# EAGLE design cndy-001 (EAGLE 9.6.2)
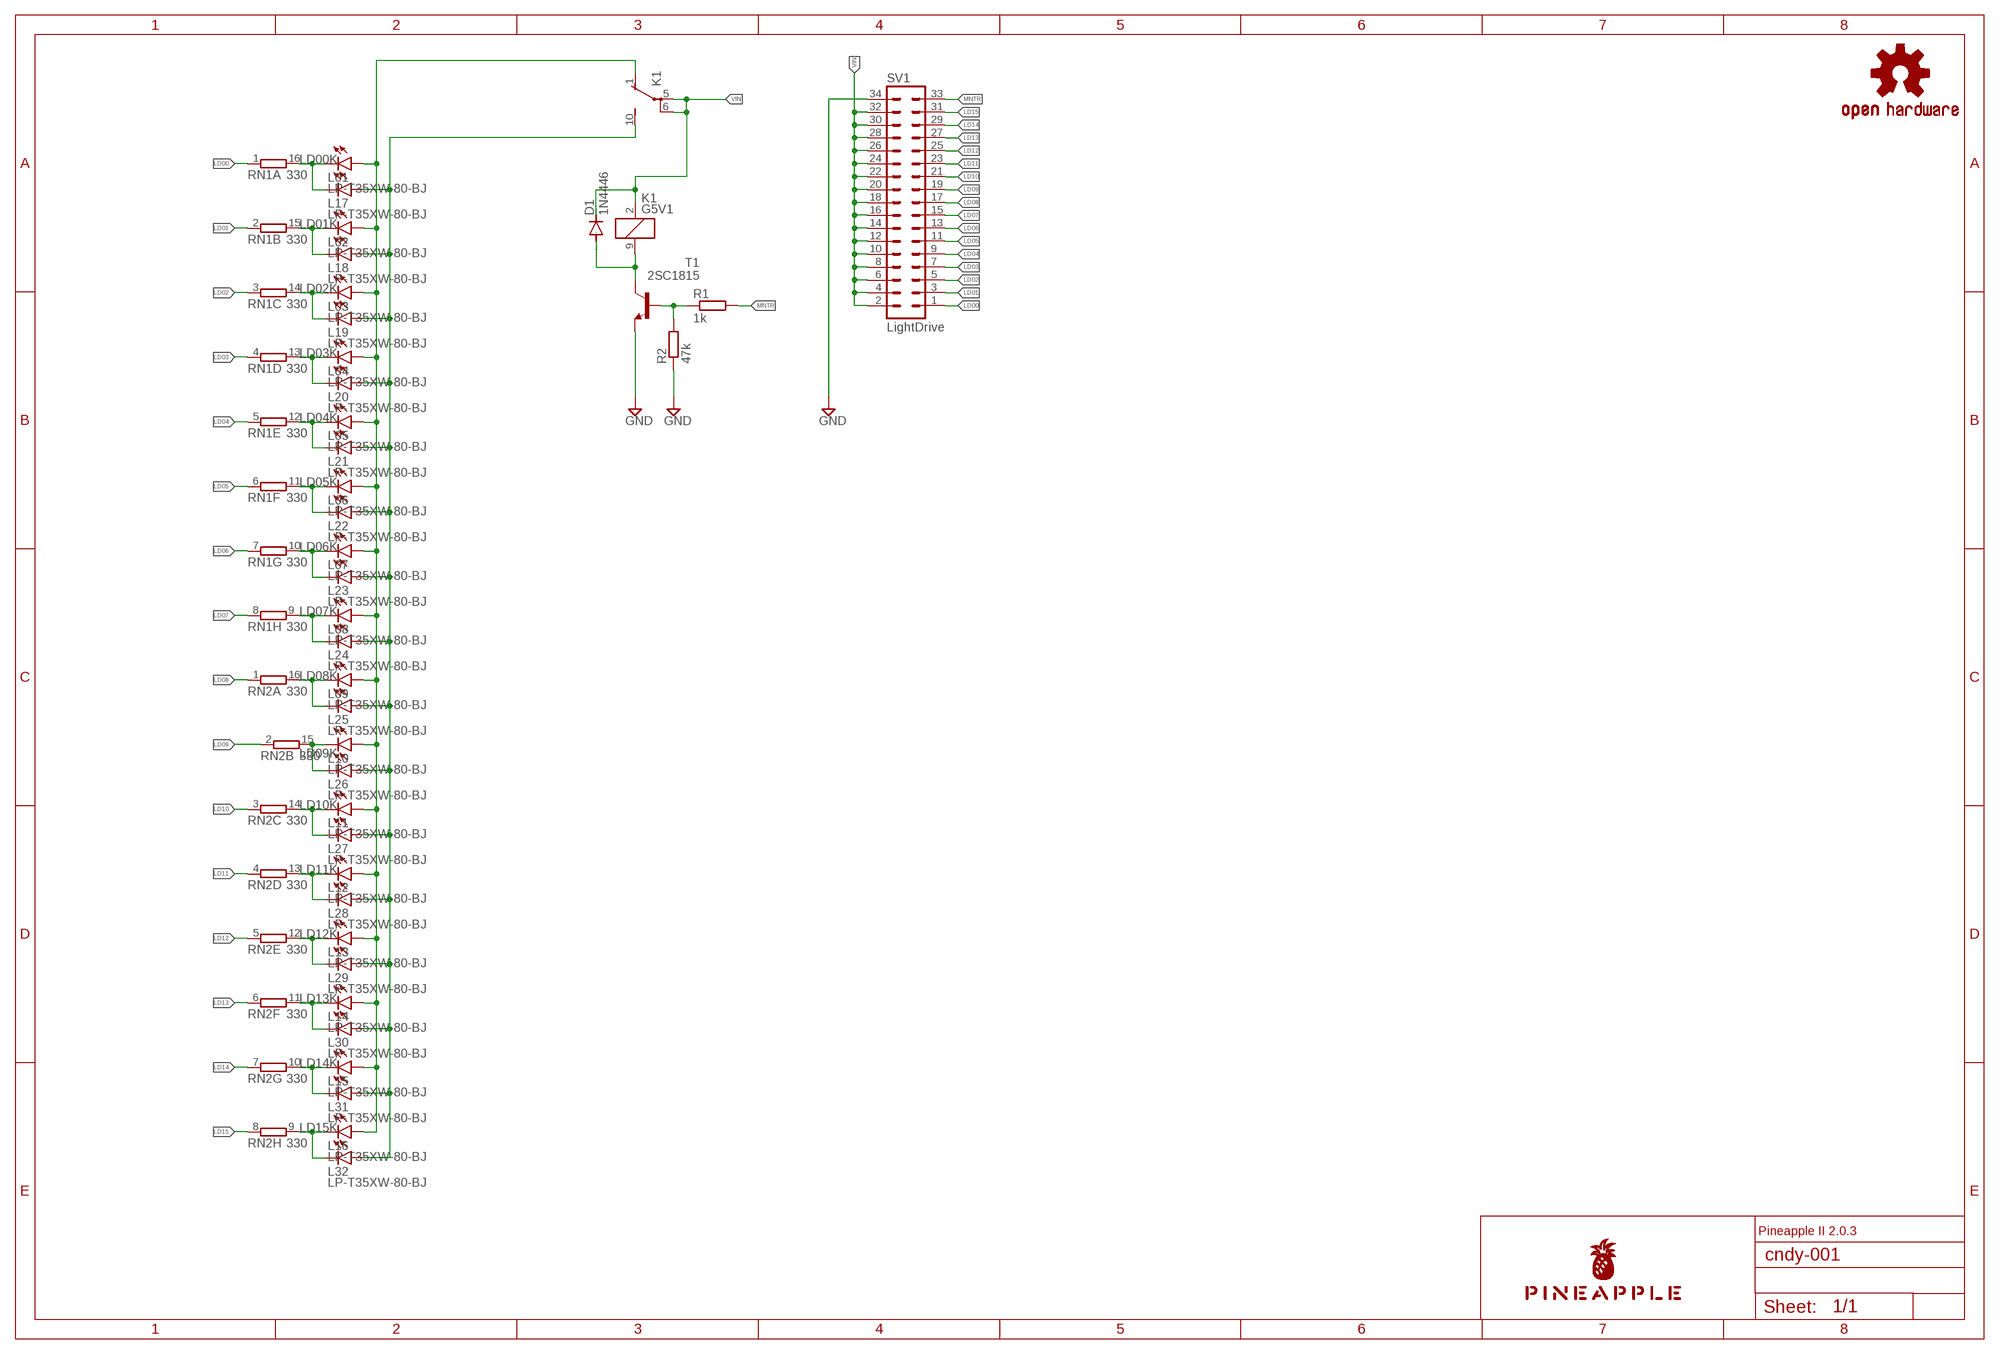
[diagram p0: schematic, sheet 1]

## Parts
D1  1N4446  [DO35-10]
K1  G5V1  [G5V1]
L01  LP-T35XW-80-BJ  LEDKA-3528ASYC  [KA-3528ASYC]
L02  LP-T35XW-80-BJ  LEDKA-3528ASYC  [KA-3528ASYC]
L03  LP-T35XW-80-BJ  LEDKA-3528ASYC  [KA-3528ASYC]
L04  LP-T35XW-80-BJ  LEDKA-3528ASYC  [KA-3528ASYC]
L05  LP-T35XW-80-BJ  LEDKA-3528ASYC  [KA-3528ASYC]
L06  LP-T35XW-80-BJ  LEDKA-3528ASYC  [KA-3528ASYC]
L07  LP-T35XW-80-BJ  LEDKA-3528ASYC  [KA-3528ASYC]
L08  LP-T35XW-80-BJ  LEDKA-3528ASYC  [KA-3528ASYC]
L09  LP-T35XW-80-BJ  LEDKA-3528ASYC  [KA-3528ASYC]
L10  LP-T35XW-80-BJ  LEDKA-3528ASYC  [KA-3528ASYC]
L11  LP-T35XW-80-BJ  LEDKA-3528ASYC  [KA-3528ASYC]
L12  LP-T35XW-80-BJ  LEDKA-3528ASYC  [KA-3528ASYC]
L13  LP-T35XW-80-BJ  LEDKA-3528ASYC  [KA-3528ASYC]
L14  LP-T35XW-80-BJ  LEDKA-3528ASYC  [KA-3528ASYC]
L15  LP-T35XW-80-BJ  LEDKA-3528ASYC  [KA-3528ASYC]
L16  LP-T35XW-80-BJ  LEDKA-3528ASYC  [KA-3528ASYC]
L17  LP-T35XW-80-BJ  LEDKA-3528ASYC  [KA-3528ASYC]
L18  LP-T35XW-80-BJ  LEDKA-3528ASYC  [KA-3528ASYC]
L19  LP-T35XW-80-BJ  LEDKA-3528ASYC  [KA-3528ASYC]
L20  LP-T35XW-80-BJ  LEDKA-3528ASYC  [KA-3528ASYC]
L21  LP-T35XW-80-BJ  LEDKA-3528ASYC  [KA-3528ASYC]
L22  LP-T35XW-80-BJ  LEDKA-3528ASYC  [KA-3528ASYC]
L23  LP-T35XW-80-BJ  LEDKA-3528ASYC  [KA-3528ASYC]
L24  LP-T35XW-80-BJ  LEDKA-3528ASYC  [KA-3528ASYC]
L25  LP-T35XW-80-BJ  LEDKA-3528ASYC  [KA-3528ASYC]
L26  LP-T35XW-80-BJ  LEDKA-3528ASYC  [KA-3528ASYC]
L27  LP-T35XW-80-BJ  LEDKA-3528ASYC  [KA-3528ASYC]
L28  LP-T35XW-80-BJ  LEDKA-3528ASYC  [KA-3528ASYC]
L29  LP-T35XW-80-BJ  LEDKA-3528ASYC  [KA-3528ASYC]
L30  LP-T35XW-80-BJ  LEDKA-3528ASYC  [KA-3528ASYC]
L31  LP-T35XW-80-BJ  LEDKA-3528ASYC  [KA-3528ASYC]
L32  LP-T35XW-80-BJ  LEDKA-3528ASYC  [KA-3528ASYC]
LOGO1  OSHW-LOGOS-COPPER  [OSHW-LOGO-S_COPPER]
R1  1k  R-EU_0204/5  [0204/5]
R2  47k  R-EU_0204/5  [0204/5]
RN1  330  8R-N  [DIL16]
RN2  330  8R-N  [DIL16]
SV1  LightDrive  ML34L  [ML34L]
T1  2SC1815  [TO92-ECB]
U$1  PINEAPPLE450_SILK  [PINEAPPLE450_SILK]

## Nets
GND [gnd]: R2.1 SV1.34 T1.E
LD00: RN1.1 SV1.1
LD00K: L01.C L17.C RN1.16
LD01: RN1.2 SV1.3
LD01K: L02.C L18.C RN1.15
LD02: RN1.3 SV1.5
LD02K: L03.C L19.C RN1.14
LD03: RN1.4 SV1.7
LD03K: L04.C L20.C RN1.13
LD04: RN1.5 SV1.9
LD04K: L05.C L21.C RN1.12
LD05: RN1.6 SV1.11
LD05K: L06.C L22.C RN1.11
LD06: RN1.7 SV1.13
LD06K: L07.C L23.C RN1.10
LD07: RN1.8 SV1.15
LD07K: L08.C L24.C RN1.9
LD08: RN2.1 SV1.17
LD08K: L09.C L25.C RN2.16
LD09: RN2.2 SV1.19
LD09K: L10.C L26.C RN2.15
LD10: RN2.3 SV1.21
LD10K: L11.C L27.C RN2.14
LD11: RN2.4 SV1.23
LD11K: L12.C L28.C RN2.13
LD12: RN2.5 SV1.25
LD12K: L13.C L29.C RN2.12
LD13: RN2.6 SV1.27
LD13K: L14.C L30.C RN2.11
LD14: RN2.7 SV1.29
LD14K: L15.C L31.C RN2.10
LD15: RN2.8 SV1.31
LD15K: L16.C L32.C RN2.9
MNTR: R1.2 SV1.33
N$17: D1.A K1.9 T1.C
N$19: R1.1 R2.2 T1.B
VIN [power]: D1.C K1.2 K1.5(2:P) K1.6(2:P) SV1.2 SV1.4 SV1.6 SV1.8 SV1.10 SV1.12 SV1.14 SV1.16 SV1.18 SV1.20 SV1.22 SV1.24 SV1.26 SV1.28 SV1.30 SV1.32
VINA [power]: K1.1(2:O) L01.A L02.A L03.A L04.A L05.A L06.A L07.A L08.A L09.A L10.A L11.A L12.A L13.A L14.A L15.A L16.A
VINB [power]: K1.10(2:S) L17.A L18.A L19.A L20.A L21.A L22.A L23.A L24.A L25.A L26.A L27.A L28.A L29.A L30.A L31.A L32.A

## Notes on the sheet
- Pineapple II 2.0.3

## Library data of the parts
D1 = diode:1N4446: DIODE high speed (Philips)
K1 = relay:G5V1: RELAY 1 x switch, 0.5 A/125 V AC, 1 A/24 V DC , Omron; MPN: G5V-1-DC24; OC_FARNELL: 9949593; OC_NEWARK: 36M6377
L01-L09 L10-L32 = led:LED: LED OSRAM: - CHIPLED LG R971, LG N971, LY N971, LG Q971, LY Q971, LO R971, LY R971 LH N974, LH R974 LS Q976, LO Q976, LY Q976 LO Q996 - Hyper CHIPLED LW Q18S LB Q993, LB Q99A, LB R99A - SideLED LS A670, LO A670, LY A670, LG A670, LP A670 LB A673, LV A673, LT A673, LW A673 LH A674 LY A675 LS A676, LA A676, LO A676, LY A676, LW A676 LS A679, LY A679, LG A679 - Hyper Micro SIDELED® LS Y876, LA Y876, LO Y876, LY Y876 LT Y87S - SmartLED LW L88C, LW L88S LB L89C, LB L89S, LG L890 LS L89K, LO L89K, LY L89K LS L896, LA L896, LO L896, LY L896 - TOPLED LS T670, LO T670, LY T670, LG T670, LP T670 LSG T670, LSP T670, LSY T670, LOP T670, LYG T670 LG T671, LOG T671, LSG T671 LB T673, LV T673, LT T673, LW T673 LH T674 LS T676, LA T676, LO T676, LY T676, LB T676, LH T676, LSB T676, LW T676 LB T67C, LV T67C, LT T67C, LS T67K, LO T67K, LY T67K, LW E67C LS E67B, LA E67B, LO E67B, LY E67B, LB E67C, LV E67C, LT E67C LW T67C LS T679, LY T679, LG T679 LS T770, LO T770, LY T770, LG T770, LP T770 LB T773, LV T773, LT T773, LW T773 LH T774 LS E675, LA E675, LY E675, LS T675 LS T776, LA T776, LO T776, LY T776, LB T776 LHGB T686 LT T68C, LB T68C - Hyper Mini TOPLED® LB M676 - Mini TOPLED Santana® LG M470 LS M47K, LO M47K, LY M47K Source: http://www.osram.convergy.de LUXEON: - LUMILED® LXK2-PW12-R00, LXK2-PW12-S00, LXK2-PW14-U00, LXK2-PW14-V00 LXK2-PM12-R00, LXK2-PM12-S00, LXK2-PM14-U00 LXK2-PE12-Q00, LXK2-PE12-R00, LXK2-PE12-S00, LXK2-PE14-T00, LXK2-PE14-U00 LXK2-PB12-K00, LXK2-PB12-L00, LXK2-PB12-M00, LXK2-PB14-N00, LXK2-PB14-P00, LXK2-PB14-Q00 LXK2-PR12-L00, LXK2-PR12-M00, LXK2-PR14-Q00, LXK2-PR14-R00 LXK2-PD12-Q00, LXK2-PD12-R00, LXK2-PD12-S00 LXK2-PH12-R00, LXK2-PH12-S00 LXK2-PL12-P00, LXK2-PL12-Q00, LXK2-PL12-R00 Source: www.luxeon.com KINGBRIGHT: KA-3528ASYC Source: www.kingbright.com
LOGO1 = SparkFun-Aesthetics:OSHW-LOGO: Open-Source Hardware (OSHW) Logo This logo indicates the piece of hardware it is found on incorporates a OSHW license and/or adheres to the definition of open source hardware found here: http://freedomdefined.org/OSHW
R1 R2 = rcl:R-EU_: RESISTOR, European symbol; SPICEPREFIX: R
RN1 RN2 = resistor-dil:8R-N: DIL RESISTOR; OC_FARNELL: unknown; OC_NEWARK: unknown
SV1 = con-ml:ML34L: HARTING; OC_FARNELL: unknown; OC_NEWARK: unknown
T1 = transistor:2SC1815: NPN EPITAXIAL TRANSISTOR Source: TOSHIBA .. 2SC1815 1.pdf
U$1 = pineapple:PINEAPPLE450_SILK

## Net classes
0 default: width 0.152 mm, drill 0.152 mm, clearance 0.152 mm
1 gnd: width 1.016 mm, drill 0.152 mm, clearance 0.152 mm
2 power: width 0.61 mm, drill 0.152 mm, clearance 0.152 mm
3 analog: width 0.305 mm, drill 0.152 mm, clearance 0.152 mm
4 superpower: width 1.016 mm, drill 0.152 mm, clearance 0.152 mm

## Board
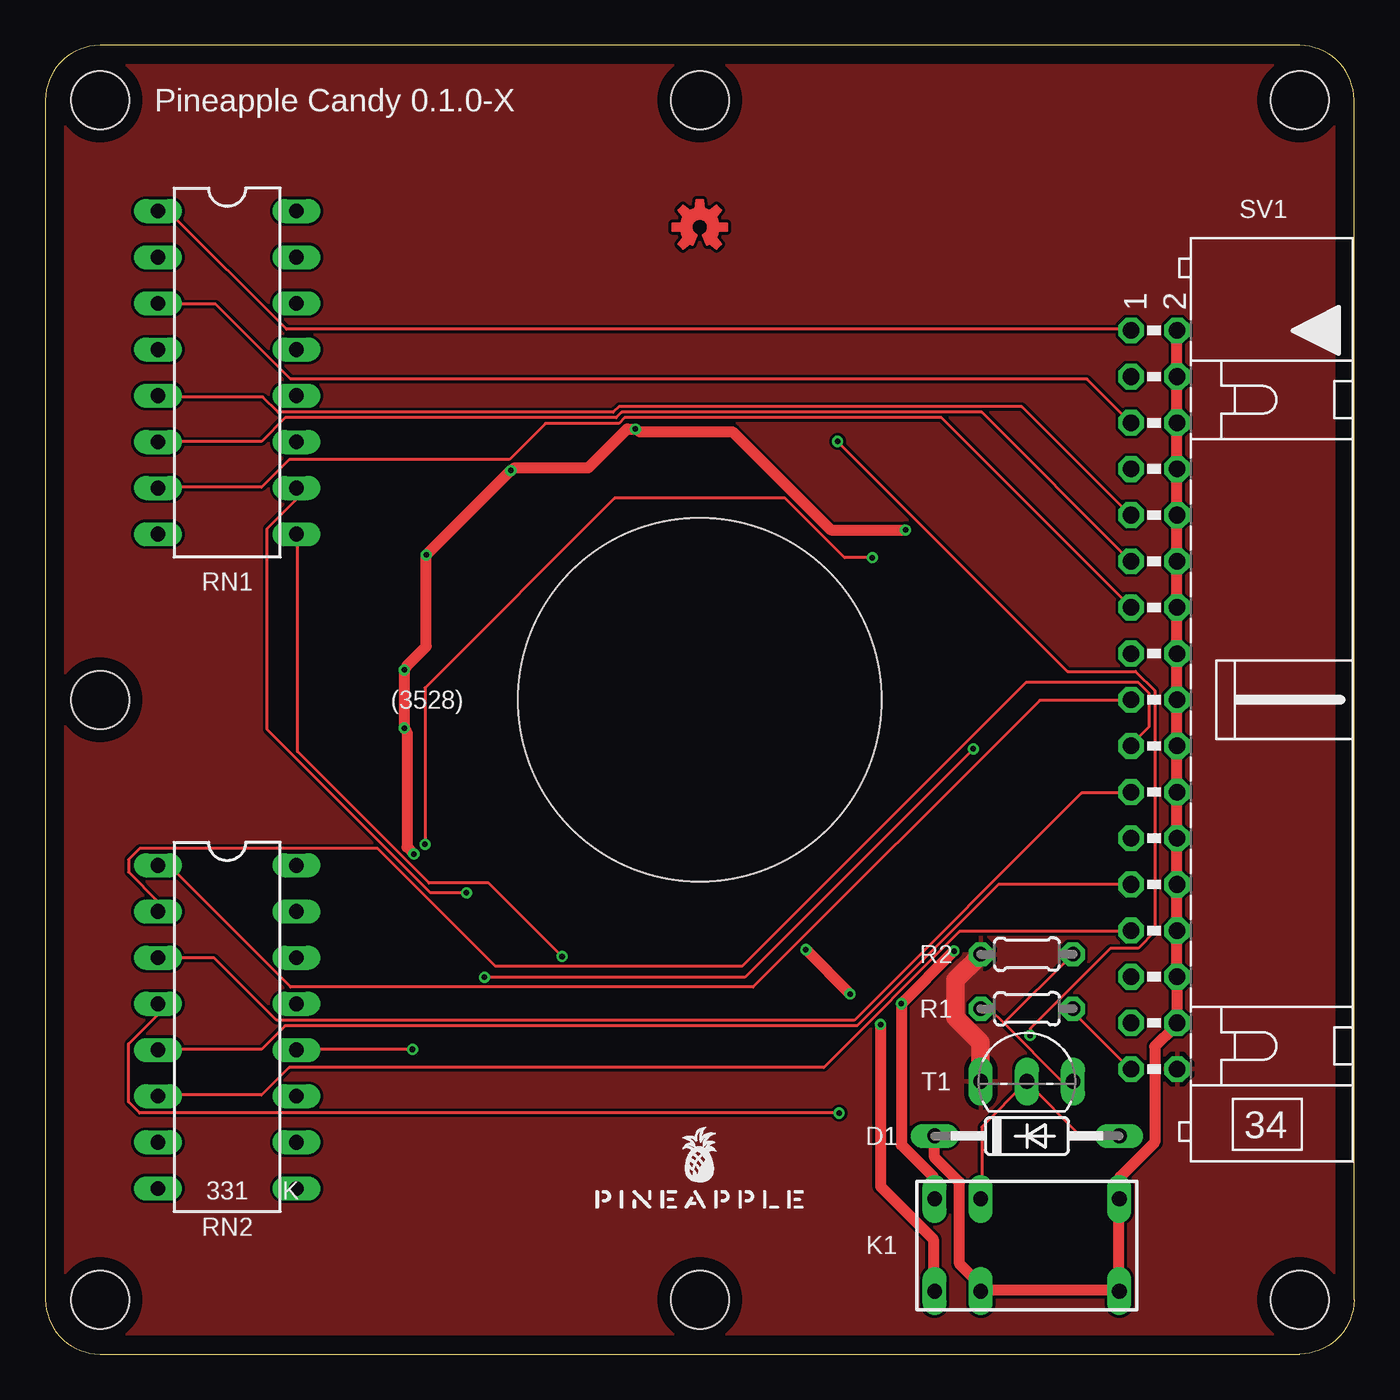
[diagram p1: board, top side]
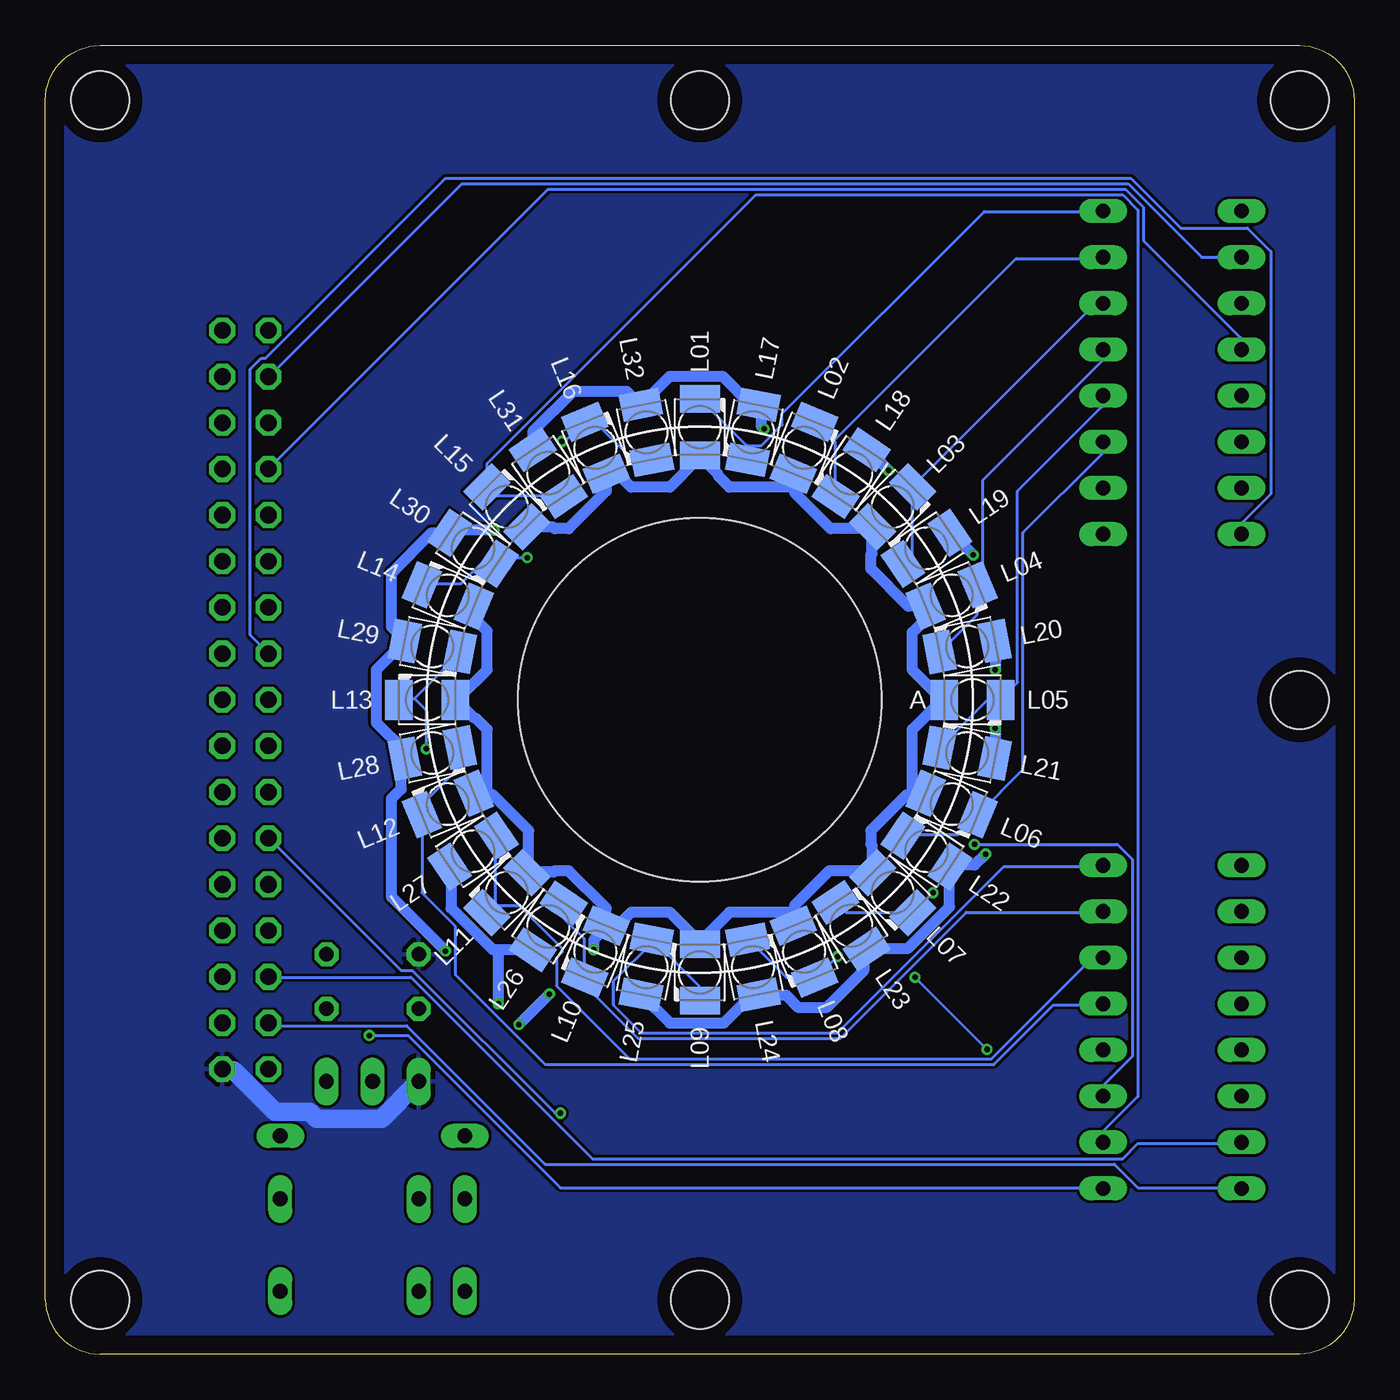
[diagram p2: board, bottom side, seen from below]

Size 72 x 72 mm. Coordinates in mm from the lower left corner, seen from the top.
Outline: 3,0 69,0 arc90 72,3 72,69 arc90 69,72 3,72 arc90 0,69 0,3 arc90 3,0
Copper layers (1*16): Top 0.035mm / dielectric 1.5mm / Bottom 0.035mm
Design rules "SeeedStudio_2layer_DRU_no_angle_20140221": minimum track width 6mil, minimum drill 12mil, track to track 6mil, track to pad 6mil, pad to pad 6mil, via to via 6mil, smd to smd 0mil, copper to edge 10mil, drill to drill 10mil, minimum pad ring 10mil, minimum via ring 6mil, stop-mask expansion 2mil, vias tented up to drill 100mil, thermal gap 10mil
Holes 3.2 mm at 3,3 3,69 36,69 36,3 69,69 69,3 3,36
Holes 20 mm at 36,36
tRestrict: area 0.8,66.8 to 5.2,71.2; area 0.8,0.8 to 5.2,5.2; area 66.8,66.8 to 71.2,71.2; area 66.8,0.8 to 71.2,5.2; area 0,71 to 72,72; area 0,0 to 72,1; area 0,0 to 1,72; area 71,0 to 72,72; area 25.5,25.5 to 46.5,46.5; area 33.8,66.8 to 38.2,71.2; area 33.8,0.8 to 38.2,5.2; area 0.8,33.8 to 5.2,38.2
bRestrict: area 0.8,0.8 to 5.2,5.2; area 0.8,66.8 to 5.2,71.2; area 33.8,0.8 to 38.2,5.2; area 0,71 to 72,72; area 0,0 to 72,1; area 0,0 to 1,72; area 71,0 to 72,72; area 25.5,25.5 to 46.5,46.5; area 66.8,0.8 to 71.2,5.2; area 33.8,66.8 to 38.2,71.2; area 66.8,66.8 to 71.2,71.2; area 0.8,33.8 to 5.2,38.2
vRestrict: area 29,7 to 43,13

### Footprints (pad centres in the part's own frame; a part is rotated, then mirrored left to right if it is on the bottom)
DO35-10 = drill 0.813 long: A 5.08,0; C -5.08,0
G5V1 = drill 0.813 long: 1 -5.08,-2.54; 2 -2.54,-2.54; 5 5.08,-2.54; 6 5.08,2.54; 9 -2.54,2.54; 10 -5.08,2.54
KA-3528ASYC = smd 1.5 x 2.2: A -1.55,0; C 1.55,0
0204/5 = drill 0.813 octagon: 1 -2.54,0; 2 2.54,0
DIL16 = drill 0.813 long: 1 -8.89,-3.81; 2 -6.35,-3.81; 3 -3.81,-3.81; 4 -1.27,-3.81; 5 1.27,-3.81; 6 3.81,-3.81; 7 6.35,-3.81; 8 8.89,-3.81; 9 8.89,3.81; 10 6.35,3.81; 11 3.81,3.81; 12 1.27,3.81; 13 -1.27,3.81; 14 -3.81,3.81; 15 -6.35,3.81; 16 -8.89,3.81
ML34L = drill 0.914 octagon: 1 -20.32,-1.27; 2 -20.32,1.27; 3 -17.78,-1.27; 4 -17.78,1.27; 5 -15.24,-1.27; 6 -15.24,1.27; 7 -12.7,-1.27; 8 -12.7,1.27; 9 -10.16,-1.27; 10 -10.16,1.27; 11 -7.62,-1.27; 12 -7.62,1.27; 13 -5.08,-1.27; 14 -5.08,1.27; 15 -2.54,-1.27; 16 -2.54,1.27; 17 0,-1.27; 18 0,1.27; 19 2.54,-1.27; 20 2.54,1.27; 21 5.08,-1.27; 22 5.08,1.27; 23 7.62,-1.27; 24 7.62,1.27; 25 10.16,-1.27; 26 10.16,1.27; 27 12.7,-1.27; 28 12.7,1.27; 29 15.24,-1.27; 30 15.24,1.27; 31 17.78,-1.27; 32 17.78,1.27; 33 20.32,-1.27; 34 20.32,1.27
TO92-ECB = drill 0.813 long: B 2.54,0; C 0,0; E -2.54,0

### Placement (x,y rotation side)
D1  54,12 0 top
K1  54,6 0 top
L01  36,51 90 bottom
L02  30.26,49.86 67.5 bottom
L03  25.39,46.61 45 bottom
L04  22.14,41.74 22.5 bottom
L05  21,36 0 bottom
L06  22.14,30.26 337.5 bottom
L07  25.39,25.39 315 bottom
L08  30.26,22.14 292.5 bottom
L09  36,21 270 bottom
L10  41.74,22.14 247.5 bottom
L11  46.61,25.39 225 bottom
L12  49.86,30.26 202.5 bottom
L13  51,36 180 bottom
L14  49.86,41.74 157.5 bottom
L15  46.61,46.61 135 bottom
L16  41.74,49.86 112.5 bottom
L17  33.07,50.71 258.7 bottom
L18  27.67,48.47 236.3 bottom
L19  23.53,44.33 213.8 bottom
L20  21.29,38.93 191.3 bottom
L21  21.29,33.07 168.8 bottom
L22  23.53,27.67 146.3 bottom
L23  27.67,23.57 123.8 bottom
L24  33.07,21.29 101.3 bottom
L25  38.93,21.29 78.8 bottom
L26  44.33,23.53 56.3 bottom
L27  48.47,27.67 33.8 bottom
L28  50.71,33.07 11.3 bottom
L29  50.71,38.93 348.8 bottom
L30  48.47,44.33 326.3 bottom
L31  44.33,48.47 303.8 bottom
L32  38.93,50.71 281.3 bottom
LOGO1  36,62 0 top
R1  54,19 0 top
R2  54,22 0 top
RN1  10,54 270 top
RN2  10,18 270 top
SV1  61,36 270 top
T1  54,15 0 top
U$1  36,8 0 top

### Tracks (layer width: path | path; a pad name or v marks a point on that pad's centre or on a via)
GND
  Top 1.016: T1.E 51.44,15.01 51.44,17.14 50.06,18.52 50.06,20.57 51.44,21.95 R2.1
  Bottom 1.016: SV1.34 62.26,15.62 61.65,15.62 59.36,13.34 57.45,13.34 57.07,12.95 53.49,12.95 51.51,14.94 T1.E
  pour Top: -2,-2 74,-2 74,74 -2,74
  pour Bottom: -4,-4 76,-4 76,76 -4,76
LD00
  Top 0.152: RN1.1 6.25,62.87 6.78,62.87 13.26,56.39 59.66,56.39 SV1.1
LD00K
  Bottom 0.152: 33.41,49.95 35.97,52.5 L01.C | 33.41,49.95 33.38,49.91 33.38,49.23 L17.C | RN1.16 13.87,62.87 20.34,62.87 31.47,51.74 31.47,51.13 32.61,49.99 33.38,49.99 33.41,49.95
LD01
  Bottom 0.152: RN1.2 6.25,60.35 8.38,60.35 12.42,64.39 49.07,64.39 59.66,53.8 SV1.3
LD01K
  Bottom 0.152: 28.61,50.25 29.64,51.28 L02.C | 28.61,50.25 28.57,50.22 28.57,47.24 L18.C | 28.61,50.25 18.59,60.27 13.87,60.27 RN1.15
LD02
  Top 0.152: RN1.3 6.25,57.76 9.37,57.76 13.49,53.65 57.3,53.65 59.66,51.28 SV1.5
LD02K
  Bottom 0.152: L19.C 24.77,43.51 24.31,43.97 24.31,47.7 L03.C 24.23,47.78 14.25,57.76 13.87,57.76 RN1.14
LD03
  Bottom 0.152: RN1.4 6.25,55.32 6.25,55.93 11.58,61.27 11.58,63.09 12.57,64.08 44.35,64.08 59.66,48.77 SV1.7
LD03K
  Bottom 0.152: L20.C 22.78,38.63 20.73,40.69 20.73,42.29 L04.C 20.65,42.37 20.42,42.6 20.42,48.08 13.87,54.63 13.87,55.24 RN1.13
LD04
  Top 0.152: RN1.5 6.25,52.65 11.96,52.65 12.8,51.82 31.24,51.82 31.55,52.12 53.72,52.12 59.66,46.18 SV1.9
LD04K
  Bottom 0.152: L21.C 22.78,33.38 20.19,35.97 19.51,35.97 L05.C 19.43,36.04 18.52,36.96 18.52,47.47 13.87,52.12 13.87,52.65 RN1.12
LD05
  Top 0.152: RN1.6 6.25,50.22 11.89,50.22 13.18,51.51 31.39,51.51 31.7,51.82 51.51,51.82 59.66,43.66 SV1.11
LD05K
  Bottom 0.152: L22.C 24.77,28.57 21.79,28.57 20.73,29.64 L06.C 20.65,29.72 18.21,32.16 18.21,45.19 13.87,49.53 13.87,50.14 RN1.11
LD06
  Top 0.152: RN1.7 6.25,47.7 11.89,47.7 13.41,49.23 25.53,49.23 27.51,51.21 31.55,51.21 31.85,51.51 49.3,51.51 59.66,41.15 SV1.13
LD06K  (via drill 0.3)
  Top 0.152: v23.16,25.38 21.18,25.38 12.19,34.37 12.19,45.41 13.79,47.02 13.79,47.62 RN1.10
  Bottom 0.152: L23.C 28.5,24.84 27.96,24.31 24.31,24.31 L07.C 24.23,24.31 v23.16,25.38
LD07
  Bottom 0.152: RN1.8 6.17,45.11 6.17,45.72 4.57,47.32 4.57,60.66 5.87,61.95 9.53,61.95 12.27,64.69 49.99,64.69 59.89,54.79 60.12,54.79 60.73,54.18 60.73,39.55 59.74,38.56 SV1.15
LD07K  (via drill 0.3)
  Top 0.152: v28.42,21.87 24.38,25.91 21.11,25.91 13.87,33.15 13.87,45.03 RN1.9
  Bottom 0.152: L24.C 33.3,22.78 31.24,20.73 29.72,20.73 L08.C 29.64,20.65 v28.42,21.87
LD08
  Top 0.152: RN2.1 6.25,26.82 6.86,26.82 13.49,20.19 38.94,20.19 54.71,35.97 59.66,35.97 SV1.17
LD08K
  Bottom 0.152: L09.C 36.04,19.51 36.04,20.27 38.56,22.78 L25.C 38.56,22.71 40.77,20.5 40.77,19.2 39.24,17.68 28.42,17.68 19.28,26.82 13.87,26.82 RN2.16
LD09
  Top 0.152: RN2.2 6.17,24.38 6.17,24.92 4.57,26.52 4.57,27.2 5.18,27.81 18.29,27.81 24.77,21.34 38.33,21.34 53.95,36.96 60.12,36.96 60.73,36.35 60.73,34.52 59.74,33.53 SV1.19
LD09K
  Bottom 0.152: L26.C 43.43,24.77 43.43,23.93 42.37,22.86 42.37,20.73 L10.C 42.29,20.65 42.29,20.27 39.4,17.37 28.27,17.37 21.34,24.31 13.87,24.31 RN2.15
LD10
  Top 0.152: RN2.3 6.25,21.79 9.3,21.79 12.72,18.36 44.5,18.36 57,30.86 59.66,30.86 SV1.21
LD10K
  Bottom 0.152: L27.C 47.24,28.5 47.24,24.77 47.7,24.31 L11.C 47.24,24.69 45.95,24.69 43.59,22.33 43.59,22.1 43.89,21.79 43.89,20.27 39.85,16.23 19.96,16.23 14.4,21.79 13.87,21.79 RN2.14
LD11  (via drill 0.3)
  Top 0.152: v43.66,13.26 5.18,13.26 4.57,13.87 4.57,17.07 6.17,18.67 6.17,19.2 RN2.4
  Bottom 0.152: v43.66,13.26 43.97,13.26 51.82,21.11 52.43,21.11 59.66,28.35 SV1.23
LD11K
  Bottom 0.152: L28.C 49.23,33.3 49.23,32.31 51.28,30.25 51.28,29.72 L12.C 51.28,29.64 51.28,25.38 49.45,23.55 49.45,20.88 44.5,15.93 19.81,15.93 16.54,19.2 13.87,19.2 RN2.13
LD12
  Top 0.152: RN2.5 6.25,16.76 11.89,16.76 13.18,18.06 44.65,18.06 52.43,25.83 59.66,25.83 SV1.25
LD12K  (via drill 0.3)
  Top 0.152: v20.19,16.76 13.87,16.76 RN2.12 | v24.16,20.73 38.48,20.73 v51.05,33.3
  Bottom 0.152: 51.7,36.08 49.23,38.56 L29.C | 51.7,36.08 51.74,36.04 52.5,36.04 L13.C | v24.16,20.73 v20.19,16.76 | v51.05,33.3 51.05,35.43 51.7,36.08
LD13
  Top 0.152: RN2.6 6.25,14.25 11.89,14.25 13.41,15.77 42.82,15.77 50.29,23.24 59.66,23.24 SV1.27
LD13K  (via drill 0.3)
  Top 0.152: v20.88,28.04 20.88,36.65 31.32,47.09 40.69,47.09 43.97,43.81 v45.49,43.81
  Bottom 0.152: L14.C 51.28,42.37 49.15,42.37 48.08,43.43 47.24,43.43 L30.C 47.17,43.51 46.86,43.81 v45.49,43.81 | v20.88,28.04 13.03,28.04 12.19,27.2 12.19,16.38 13.79,14.78 13.79,14.25 RN2.11
LD14
  Bottom 0.152: RN2.7 6.25,11.58 11.89,11.58 12.72,10.74 41.91,10.74 51.89,20.73 59.66,20.73 SV1.29
LD14K
  Bottom 0.152: L31.C 43.51,47.24 47.24,47.24 L15.C 47.7,47.78 47.7,49 32.92,63.78 12.72,63.78 11.89,62.94 11.89,14.17 13.79,12.27 13.79,11.66 RN2.10
LD15
  Bottom 0.152: RN2.8 6.25,9.14 11.89,9.14 13.18,10.44 44.5,10.44 52.12,18.06 59.51,18.06 59.66,18.21 SV1.31
LD15K  (via drill 0.3)
  Top 0.152: v54.18,17.53 54.18,17.91 58.6,22.33 60.12,22.33 61.04,23.24 61.04,36.5 59.97,37.57 56.24,37.57 v43.59,50.22
  Bottom 0.152: L32.C 38.63,49.23 39.7,49.23 41.76,51.28 42.29,51.28 L16.C 42.37,51.28 43.43,50.22 v43.59,50.22 | v54.18,17.53 52.05,17.53 43.66,9.14 13.87,9.14 RN2.9
MNTR
  Top 0.152: R1.2 56.54,18.97 56.54,18.82 59.66,15.7 SV1.33
N$17
  Top 0.152: K1.9 51.51,8.61 51.51,12.5 53.95,14.94 T1.C 54.03,14.94 56.92,12.04 59.05,12.04 D1.A
N$19
  Top 0.152: 52.73,18.21 51.97,18.97 51.51,18.97 R1.1 | 52.73,18.21 55.93,15.01 56.46,15.01 T1.B | 52.73,18.21 56.46,21.95 R2.2
VIN
  Top 0.61: D1.C 48.92,11.96 48.92,10.82 50.29,9.45 50.29,4.95 51.44,3.81 K1.2 51.51,3.5 59.05,3.5 K1.5 59.05,3.81 59.05,8.53 K1.6 59.13,8.84 59.13,9.75 61.04,11.66 61.04,16.92 62.1,17.98 SV1.32 62.26,18.29 62.26,20.73 SV1.30 62.26,21.03 62.26,23.24 SV1.28 62.26,23.55 62.26,25.83 SV1.26 62.26,26.14 62.26,28.35 SV1.24 62.26,28.65 62.26,30.86 SV1.22 62.26,31.17 62.26,33.45 SV1.20 62.26,33.76 62.26,35.97 SV1.18 62.26,36.27 62.26,38.48 SV1.16 62.26,38.79 62.26,41.07 SV1.14 62.26,41.38 62.26,43.59 SV1.12 62.26,43.89 62.26,46.1 SV1.10 62.26,46.41 62.26,48.69 SV1.8 62.26,49 62.26,51.21 SV1.6 62.26,51.51 62.26,53.72 SV1.4 62.26,54.03 62.26,56.31 SV1.2
VINA  (via drill 0.3)
  Top 0.61: v45.95,18.14 45.95,9.22 48.84,6.33 48.84,3.5 K1.1 | v41.83,22.25 v44.27,19.81
  Bottom 0.61: L10.A 41.07,23.62 40.46,23.62 39.78,24.31 37.64,24.31 36.2,22.86 L09.A 35.97,22.55 35.97,22.71 34.37,24.31 31.01,24.31 L08.A 30.79,23.62 30.79,24.69 28.88,26.59 26.75,26.59 L07.A 26.52,26.52 26.52,27.96 26.59,28.04 26.59,28.8 24.61,30.79 23.62,30.79 L06.A 24.31,31.01 24.31,34.37 22.71,35.97 22.55,35.97 L05.A 22.86,36.2 24.31,37.64 24.31,39.7 23.62,40.39 23.62,41.07 L04.A 23.93,41.15 24.54,41.15 26.59,43.2 26.59,43.97 26.52,44.04 26.52,45.49 L03.A 26.82,45.41 28.8,45.41 30.79,47.4 30.79,48.39 L02.A 31.01,47.7 34.37,47.7 34.98,48.31 34.98,48.39 35.97,49.38 L01.A 36.2,49.15 37.64,47.7 39.78,47.7 40.46,48.39 41.07,48.39 L16.A 41.15,48.08 41.15,47.47 43.2,45.41 43.97,45.41 44.04,45.49 45.49,45.49 L15.A | L10.A 41.15,23.93 41.15,24.54 43.2,26.59 43.97,26.59 44.04,26.52 45.49,26.52 L11.A 45.41,26.82 45.41,28.8 47.4,30.79 48.39,30.79 L12.A 47.7,31.01 47.7,34.37 48.31,34.98 48.39,34.98 49.38,35.97 L13.A 49.15,36.2 47.7,37.64 47.7,39.78 48.39,40.46 48.39,41.07 L14.A | v44.27,19.81 v45.95,18.14 | v41.83,22.25 41.83,22.78 41.3,23.32 L10.A
VINB  (via drill 0.3)
  Top 0.61: K1.10 48.84,8.61 48.84,9.75 47.09,11.51 v47.09,19.28 v49.99,22.17 | v20.27,27.51 19.89,27.89 19.89,34.21 v19.74,34.44 v19.74,37.64 19.89,37.87 20.95,38.94 v20.95,43.97 v25.6,48.62 25.83,48.77 29.87,48.77 32,50.9 v32.46,50.9 32.69,50.75 37.8,50.75 43.2,45.34 v47.32,45.34
  Bottom 0.61: 47.09,22.25 47.4,22.25 49.68,24.54 49.68,26.75 L27.A | 47.09,22.25 45.26,22.25 L26.A | 47.09,22.25 v47.09,19.28 | v49.99,22.17 52.96,25.15 52.96,30.56 52.43,31.09 52.43,32.54 L28.A 52.27,32.84 52.27,33.22 53.8,34.75 53.8,37.64 52.27,39.17 L29.A 52.43,39.47 52.96,40.01 52.96,42.98 50.75,45.19 49.84,45.19 L30.A 49.53,45.34 v47.32,45.34 | L25.A 39.17,19.74 37.64,18.21 34.67,18.21 33.15,19.74 32.84,19.74 L24.A 32.46,19.74 31.24,19.74 30.56,19.05 29.03,19.05 26.98,21.11 26.98,22.02 L23.A 26.75,22.33 24.54,22.33 22.25,24.61 22.25,26.75 L22.A 21.95,26.9 20.88,26.9 v20.27,27.51 | L31.A 45.19,50.75 42.98,52.96 40.01,52.96 39.47,52.43 L32.A 39.17,52.27 37.64,53.8 34.75,53.8 33.22,52.27 32.84,52.27 L17.A 32.61,51.97 32.61,51.05 v32.46,50.9 | v19.74,34.44 19.74,32.84 L21.A | v19.74,37.64 19.74,39.17 L20.A | v20.95,43.97 22.17,45.19 L19.A | v25.6,48.62 26.75,49.76 L18.A

### Text on the board
tNames: Pineapple Candy 0.1.0-X | (3528) | 331 | K
bNames: A